# EAGLE schematic MRCS-8xDPDT-Relay (EAGLE 7.7.0)
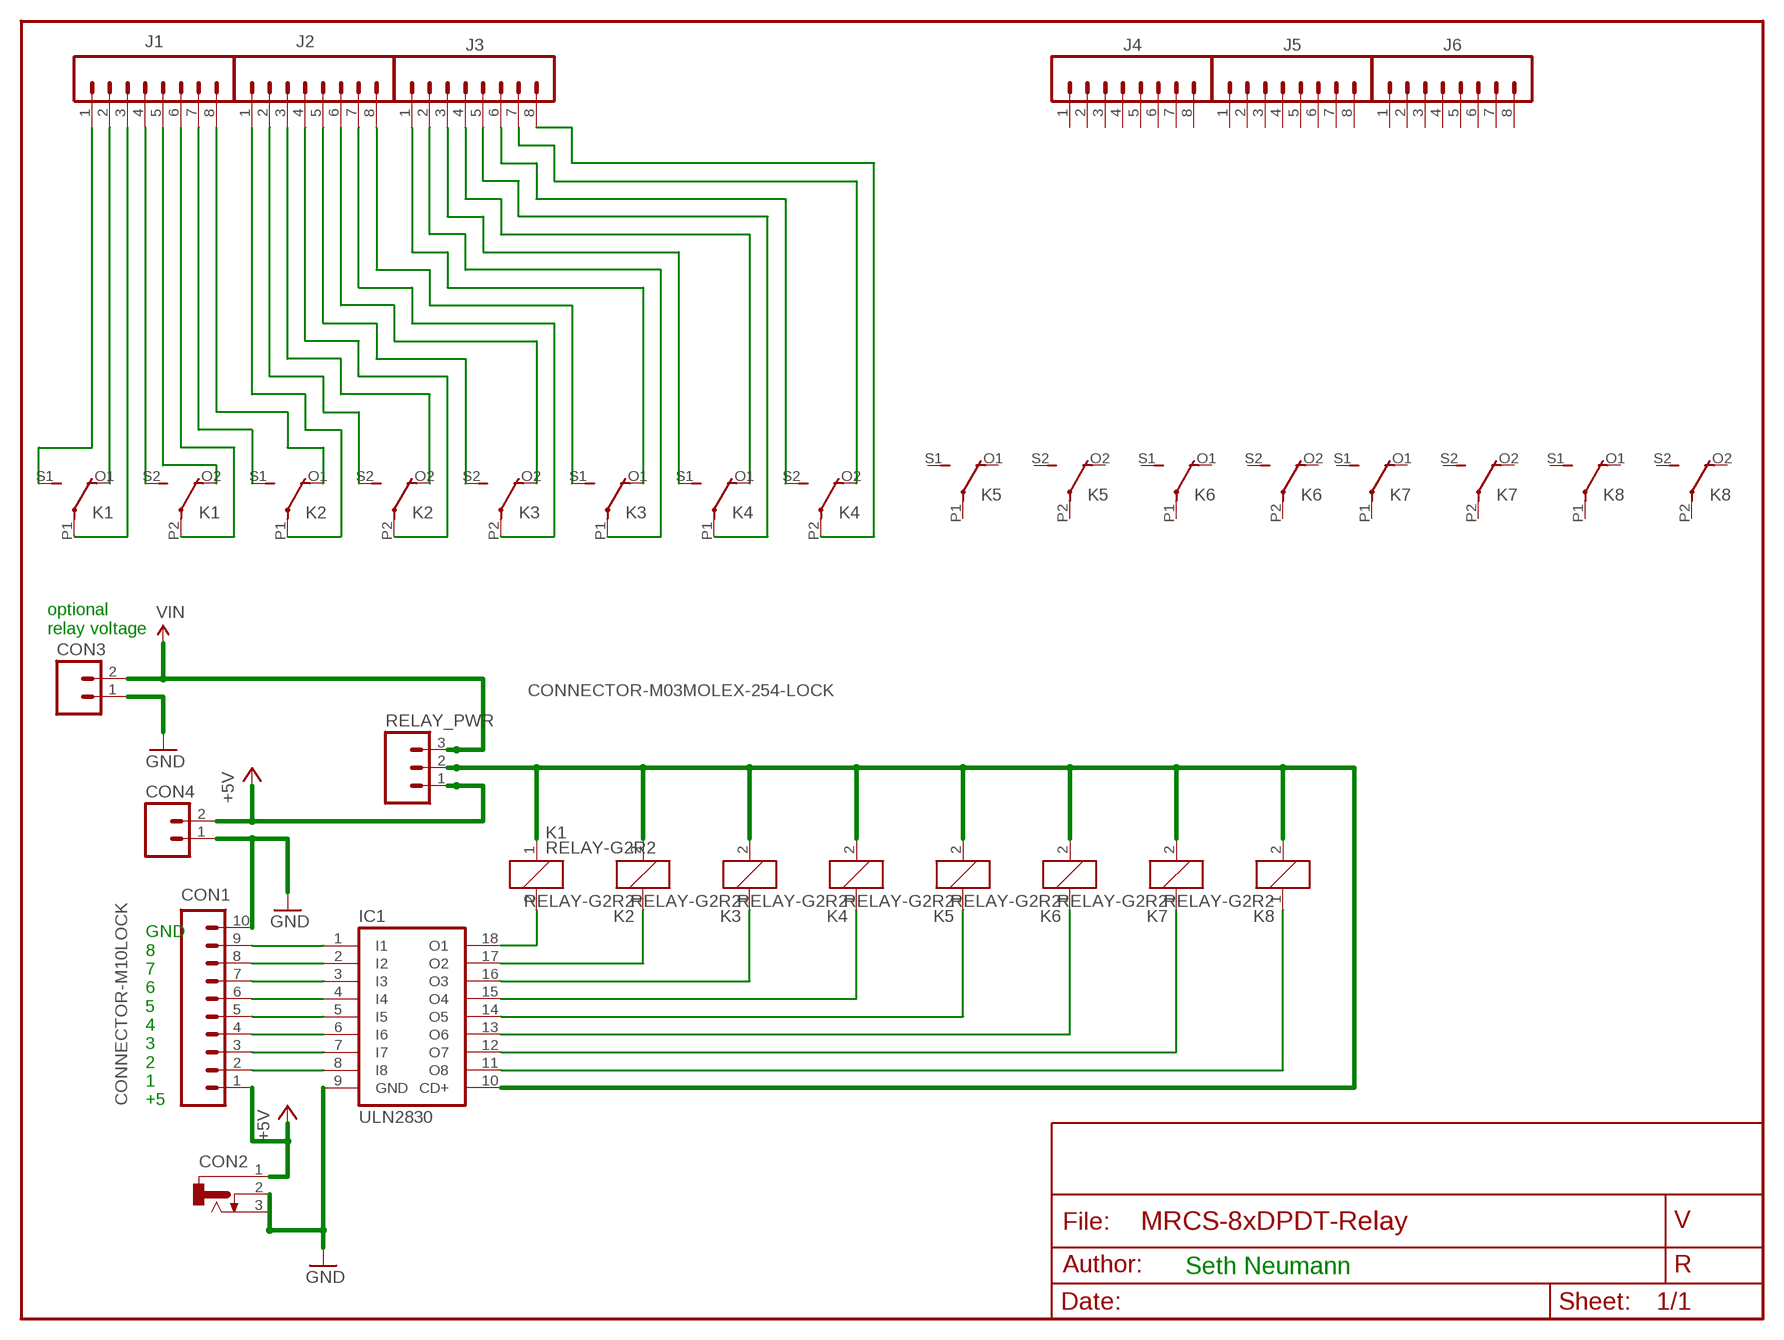
[diagram p0: schematic, sheet 1]

## Parts
CON1  CONNECTOR-M10LOCK  [1X10_LOCK]
CON2  CONNECTOR-DC-POWER-RA  [DCJ0202]
CON3  CONNECTOR-M023.5MM-LOCK  [SCREWTERMINAL-3.5MM-2_LOCK]
CON4  CONNECTOR-M023.5MM-LOCK  [SCREWTERMINAL-3.5MM-2_LOCK]
IC1  ULN2830  ULN2803A  [DIL18]
J1  CONNECTOR-M08LOCK  [1X08_LOCK]
J2  CONNECTOR-M08LOCK  [1X08_LOCK]
J3  CONNECTOR-M08LOCK  [1X08_LOCK]
J4  CONNECTOR-M08LOCK  [1X08_LOCK]
J5  CONNECTOR-M08LOCK  [1X08_LOCK]
J6  CONNECTOR-M08LOCK  [1X08_LOCK]
K1  RELAY-G2R2  [G2R2]
K2  RELAY-G2R2  [G2R2]
K3  RELAY-G2R2  [G2R2]
K4  RELAY-G2R2  [G2R2]
K5  RELAY-G2R2  [G2R2]
K6  RELAY-G2R2  [G2R2]
K7  RELAY-G2R2  [G2R2]
K8  RELAY-G2R2  [G2R2]
RELAY_PWR  CONNECTOR-M03MOLEX-254-LOCK  [MOLEX-1X3_LOCK]

## Nets
+5V: CON1.1 CON2.1 CON4.2(B) RELAY_PWR.1
GND: CON1.10 CON2.2 CON2.3 CON3.1(A) CON4.1(A) IC1.9(GND)
N$1: CON1.9 IC1.1(I1)
N$2: CON1.8 IC1.2(I2)
N$3: CON1.7 IC1.3(I3)
N$4: CON1.6 IC1.4(I4)
N$5: CON1.5 IC1.5(I5)
N$6: CON1.4 IC1.6(I6)
N$7: CON1.3 IC1.7(I7)
N$8: CON1.2 IC1.8(I8)
N$9: IC1.17(O2) K2.1
N$10: IC1.16(O3) K3.1
N$11: IC1.15(O4) K4.1
N$12: IC1.14(O5) K5.1
N$13: IC1.18(O1) K1.2
N$14: IC1.13(O6) K6.1
N$15: IC1.12(O7) K7.1
N$16: IC1.11(O8) K8.1
N$17: IC1.10(CD+) K1.1 K2.2 K3.2 K4.2 K5.2 K6.2 K7.2 K8.2 RELAY_PWR.2
N$18: J1.1 K1.S1(2:S)
N$19: J1.2 K1.O1(2:O)
N$20: J1.3 K1.P1(2:P)
N$21: J1.4 K1.S2(3:S)
N$22: J1.5 K1.O2(3:O)
N$23: J1.6 K1.P2(3:P)
N$24: J1.7 K2.S1(2:S)
N$25: J1.8 K2.O1(2:O)
N$26: J2.1 K2.P1(2:P)
N$27: J2.2 K2.S2(3:S)
N$28: J2.3 K2.O2(3:O)
N$29: J2.4 K2.P2(3:P)
N$30: J2.7 K3.P2(3:P)
N$31: J2.6 K3.O2(3:O)
N$32: J2.8 K3.S1(2:S)
N$33: J2.5 K3.S2(3:S)
N$34: J3.1 K3.O1(2:O)
N$35: J3.2 K3.P1(2:P)
N$36: J3.3 K4.S1(2:S)
N$37: J3.4 K4.O1(2:O)
N$38: J3.5 K4.P1(2:P)
N$39: J3.6 K4.S2(3:S)
N$40: J3.7 K4.O2(3:O)
N$41: J3.8 K4.P2(3:P)
VIN: CON3.2(B) RELAY_PWR.3
Unconnected: J4.1 J4.2 J4.3 J4.4 J4.5 J4.6 J4.7 J4.8 J5.1 J5.2 J5.3 J5.4 J5.5 J5.6 J5.7 J5.8 J6.1 J6.2 J6.3 J6.4 J6.5 J6.6 J6.7 J6.8 K5.O1(2:O) K5.O2(3:O) K5.P1(2:P) K5.P2(3:P) K5.S1(2:S) K5.S2(3:S) K6.O1(2:O) K6.O2(3:O) K6.P1(2:P) K6.P2(3:P) K6.S1(2:S) K6.S2(3:S) K7.O1(2:O) K7.O2(3:O) K7.P1(2:P) K7.P2(3:P) K7.S1(2:S) K7.S2(3:S) K8.O1(2:O) K8.O2(3:O) K8.P1(2:P) K8.P2(3:P) K8.S1(2:S) K8.S2(3:S)

## Notes on the sheet
- optional 
  relay voltage
- GND
  8
  7
  6
  5
  4
  3
  2
  1
  +5
- Seth Neumann

## Library data of the parts
CON1 = SPCoast:CONNECTOR-M10: Header 10 Standard 10-pin 0.1" header. Use with straight break away headers (SKU : PRT-00116), right angle break away headers (PRT-00553), swiss pins (PRT-00743), machine pins (PRT-00117), and female headers (PRT-00115).
CON2 = SPCoast:CONNECTOR-DC-POWER: DC POWER JACK
CON3 CON4 = SPCoast:CONNECTOR-M02: PHOENIX CONNECTOR
IC1 = MRCS:ULN2803A: DRIVER ARRAY
J1-J6 = SPCoast:CONNECTOR-M08: Header 8 Standard 8-pin 0.1" header. Use with straight break away headers (SKU : PRT-00116), right angle break away headers (PRT-00553), swiss pins (PRT-00743), machine pins (PRT-00117), and female headers (PRT-00115).
K1-K8 = SPCoast:RELAY-G2R2: RELAY 2 x switch, Omron; MF: OMRON COMPONENTS USA; MPN: G2R-2-DC6; OC_FARNELL: unknown; OC_NEWARK: 89C5317
RELAY_PWR = SPCoast:CONNECTOR-M03